# EAGLE design HesAKeeper (EAGLE 9.6.2)
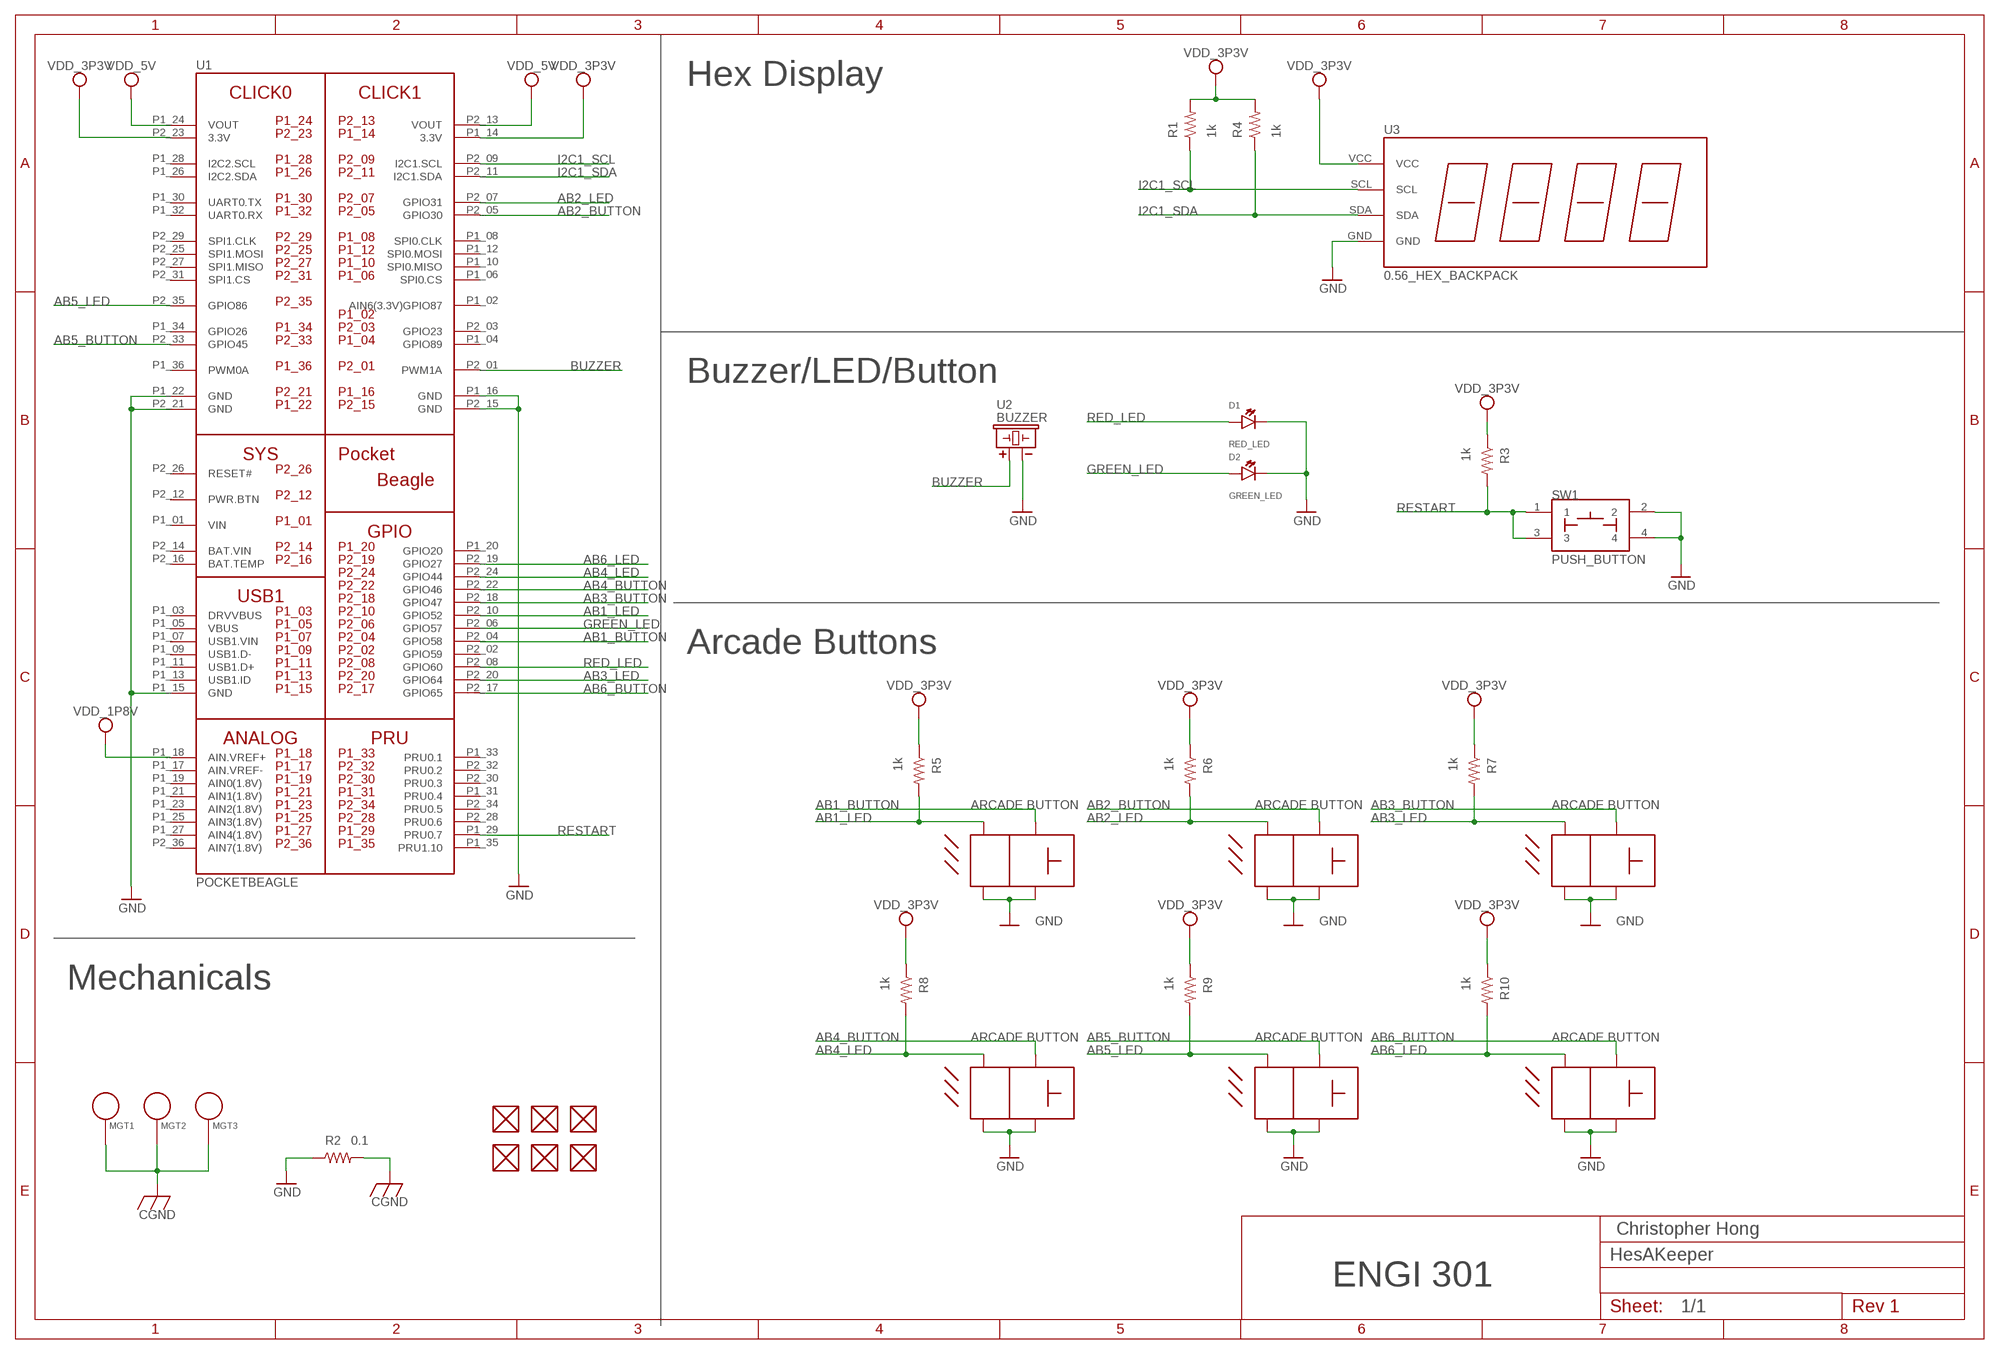
[diagram p0: schematic, sheet 1]

## Parts
AB1  ARCADE_BUTTON  [ARCADE_BUTTON]
AB2  ARCADE_BUTTON  [ARCADE_BUTTON]
AB3  ARCADE_BUTTON  [ARCADE_BUTTON]
AB4  ARCADE_BUTTON  [ARCADE_BUTTON]
AB5  ARCADE_BUTTON  [ARCADE_BUTTON]
AB6  ARCADE_BUTTON  [ARCADE_BUTTON]
D1  RED_LED  LED  [EIA-STD]
D2  GREEN_LED  LED  [EIA-STD]
FUD1  FIDUCIAL  [FIDUCIAL_40MIL]
FUD2  FIDUCIAL  [FIDUCIAL_40MIL]
FUD3  FIDUCIAL  [FIDUCIAL_40MIL]
FUD4  FIDUCIAL  [FIDUCIAL_40MIL]
FUD5  FIDUCIAL  [FIDUCIAL_40MIL]
FUD6  FIDUCIAL  [FIDUCIAL_40MIL]
MGT1  MOUNTING_HOLE  [MOUNTING_HOLE]
MGT2  MOUNTING_HOLE  [MOUNTING_HOLE]
MGT3  MOUNTING_HOLE  [MOUNTING_HOLE]
R1  1k  R_R0603  [R0603]
R2  0.1  R_R0603  [R0603]
R3  1k  R_R0603  [R0603]
R4  1k  R_R0603  [R0603]
R5  1k  R_R0603  [R0603]
R6  1k  R_R0603  [R0603]
R7  1k  R_R0603  [R0603]
R8  1k  R_R0603  [R0603]
R9  1k  R_R0603  [R0603]
R10  1k  R_R0603  [R0603]
SW1  PUSH_BUTTON  [BUTTON_12.5MM]
U1  POCKETBEAGLE  [POCKETBEAGLE]
U2  BUZZER  [BUZZER_6.5MM]
U3  0.56_HEX_BACKPACK  [0.56_HEX_BACKPACK]

## Nets
AB1_BUTTON: AB1.BUTTON_ANODE U1.P2_04(GPIO58)
AB1_LED: AB1.LED_ANODE R5.2 U1.P2_10(GPIO52)
AB2_BUTTON: AB2.BUTTON_ANODE U1.P2_05(GPIO30)
AB2_LED: AB2.LED_ANODE R6.2 U1.P2_07(GPIO31)
AB3_BUTTON: AB3.BUTTON_ANODE U1.P2_18(GPIO47)
AB3_LED: AB3.LED_ANODE R7.2 U1.P2_20(GPIO64)
AB4_BUTTON: AB4.BUTTON_ANODE U1.P2_22(GPIO46)
AB4_LED: AB4.LED_ANODE R8.2 U1.P2_24(GPIO44)
AB5_BUTTON: AB5.BUTTON_ANODE U1.P2_33(GPIO45)
AB5_LED: AB5.LED_ANODE R9.2 U1.P2_35(GPIO86)
AB6_BUTTON: AB6.BUTTON_ANODE U1.P2_17(GPIO65)
AB6_LED: AB6.LED_ANODE R10.2 U1.P2_19(GPIO27)
BUZZER: U1.P2_01(PWM1A) U2.+
CGND: MGT1.P$1 MGT2.P$1 MGT3.P$1 R2.2
GND: AB1.BUTTON_CATHODE AB1.LED_CATHODE AB2.BUTTON_CATHODE AB2.LED_CATHODE AB3.BUTTON_CATHODE AB3.LED_CATHODE AB4.BUTTON_CATHODE AB4.LED_CATHODE AB5.BUTTON_CATHODE AB5.LED_CATHODE AB6.BUTTON_CATHODE AB6.LED_CATHODE D1.CATHODE D2.CATHODE R2.1 U1.P1_15(GND) U1.P1_16(GND) U1.P1_22(GND) U1.P2_15(GND) U1.P2_21(GND) U2.- U3.GND
GREEN_LED: D2.ANODE U1.P2_06(GPIO57)
I2C1_SCL: R1.1 U1.P2_09(I2C1.SCL) U3.SCL
I2C1_SDA: R4.1 U1.P2_11(I2C1.SDA) U3.SDA
N$2: SW1.2 SW1.4 ; supply symbol labelled GND
RED_LED: D1.ANODE U1.P2_08(GPIO60)
RESTART: R3.2 SW1.1 SW1.3 U1.P1_29(PRU0.7)
VDD_1P8V: U1.P1_18(AIN.VREF+)
VDD_3P3V: R1.2 R3.1 R4.2 R5.1 R6.1 R7.1 R8.1 R9.1 R10.1 U1.P1_14(3.3V) U1.P2_23(3.3V) U3.VCC
VDD_5V: U1.P1_24(VOUT) U1.P2_13(VOUT)
Unconnected: FUD1.P$1 FUD2.P$1 FUD3.P$1 FUD4.P$1 FUD5.P$1 FUD6.P$1 U1.P1_02(AIN6(3.3V)GPIO87) U1.P1_03(DRVVBUS) U1.P1_04(GPIO89) U1.P1_05(VBUS) U1.P1_06(SPI0.CS) U1.P1_07(USB1.VIN) U1.P1_08(SPI0.CLK) U1.P1_09(USB1.D-) U1.P1_10(SPI0.MISO) U1.P1_11(USB1.D+) U1.P1_12(SPI0.MOSI) U1.P1_13(USB1.ID) U1.P1_17(AIN.VREF-) U1.P1_19(AIN0(1.8V)) U1.P1_20(GPIO20) U1.P1_21(AIN1(1.8V)) U1.P1_23(AIN2(1.8V)) U1.P1_25(AIN3(1.8V)) U1.P1_26(I2C2.SDA) U1.P1_27(AIN4(1.8V)) U1.P1_28(I2C2.SCL) U1.P1_30(UART0.TX) U1.P1_31(PRU0.4) U1.P1_32(UART0.RX) U1.P1_33(PRU0.1) U1.P1_34(GPIO26) U1.P1_35(PRU1.10) U1.P1_36(PWM0A) U1.P2_02(GPIO59) U1.P2_03(GPIO23) U1.P2_12(PWR.BTN) U1.P2_16(BAT.TEMP) U1.P2_25(SPI1.MOSI) U1.P2_26(RESET#) U1.P2_27(SPI1.MISO) U1.P2_28(PRU0.6) U1.P2_29(SPI1.CLK) U1.P2_30(PRU0.3) U1.P2_31(SPI1.CS) U1.P2_32(PRU0.2) U1.P2_34(PRU0.5) U1.P2_36(AIN7(1.8V))

## Notes on the sheet
- Hex Display
- Buzzer/LED/Button
- Arcade Buttons
- Mechanicals
- Christopher Hong
- ENGI 301
- 1/1

## Power pins joined to a net without a drawn wire
BAT.VIN: U1.P2_14(BAT.VIN)
VIN: U1.P1_01(VIN)

## Library data of the parts
AB1-AB6 = HesAKeeper:ARCADE_BUTTON: Arcade Button for He's A Keeper Project
D1 D2 = combo_lock:LED: EIA-STD LED, LTST-C191TBKT
FUD1-FUD6 = combo_lock:FIDUCIAL
MGT1-MGT3 = combo_lock:MOUNTING_HOLE: Chassis Mounting Hole w/GND connection ability
R1-R10 = combo_lock:R_: RESISTOR, American symbol
SW1 = combo_lock:PUSH_BUTTON
U1 = combo_lock:POCKETBEAGLE
U2 = combo_lock:BUZZER: CEM-1203 Buzzer
U3 = combo_lock:0.56_HEX_BACKPACK: 0.56" LED HEX Backback - Adafruit HT16K33 - https://www.adafruit.com/product/878 - https://www.adafruit.com/product/879 - https://www.adafruit.com/product/880 - https://www.adafruit.com/product/881 - https://www.adafruit.com/product/1002

## Board
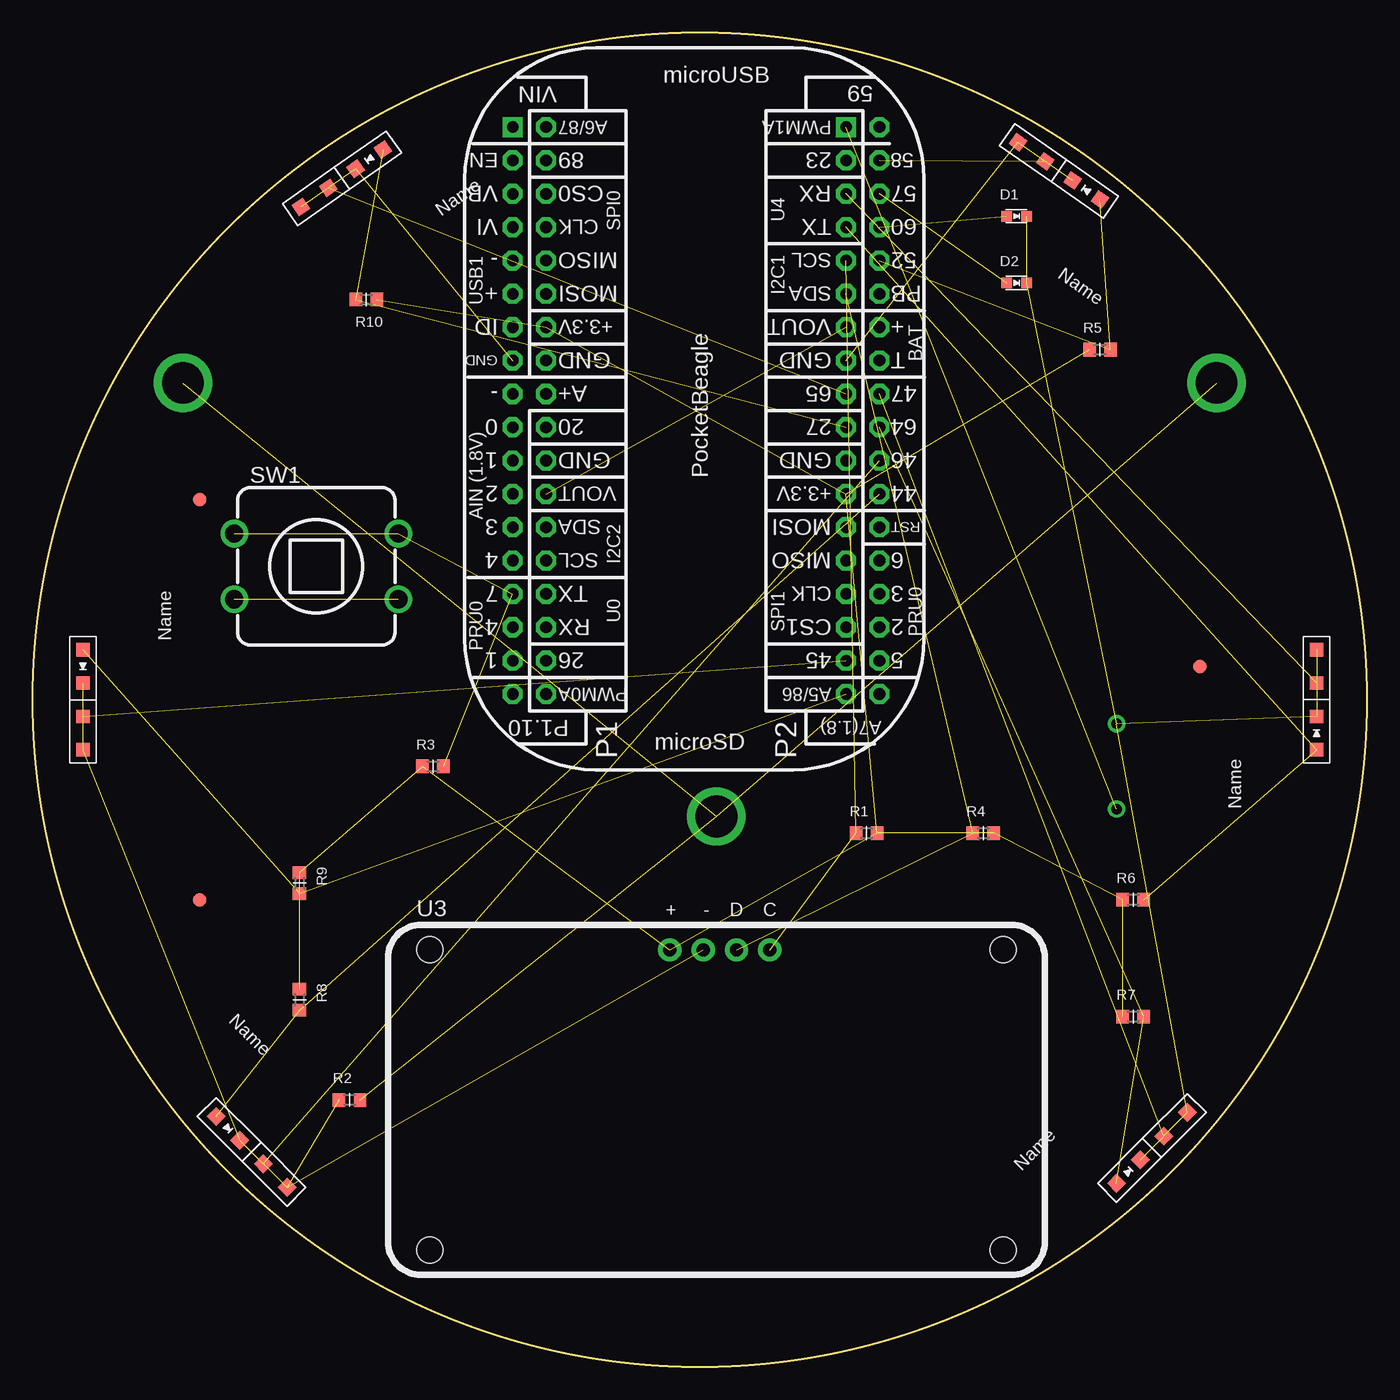
[diagram p1: board, top side]
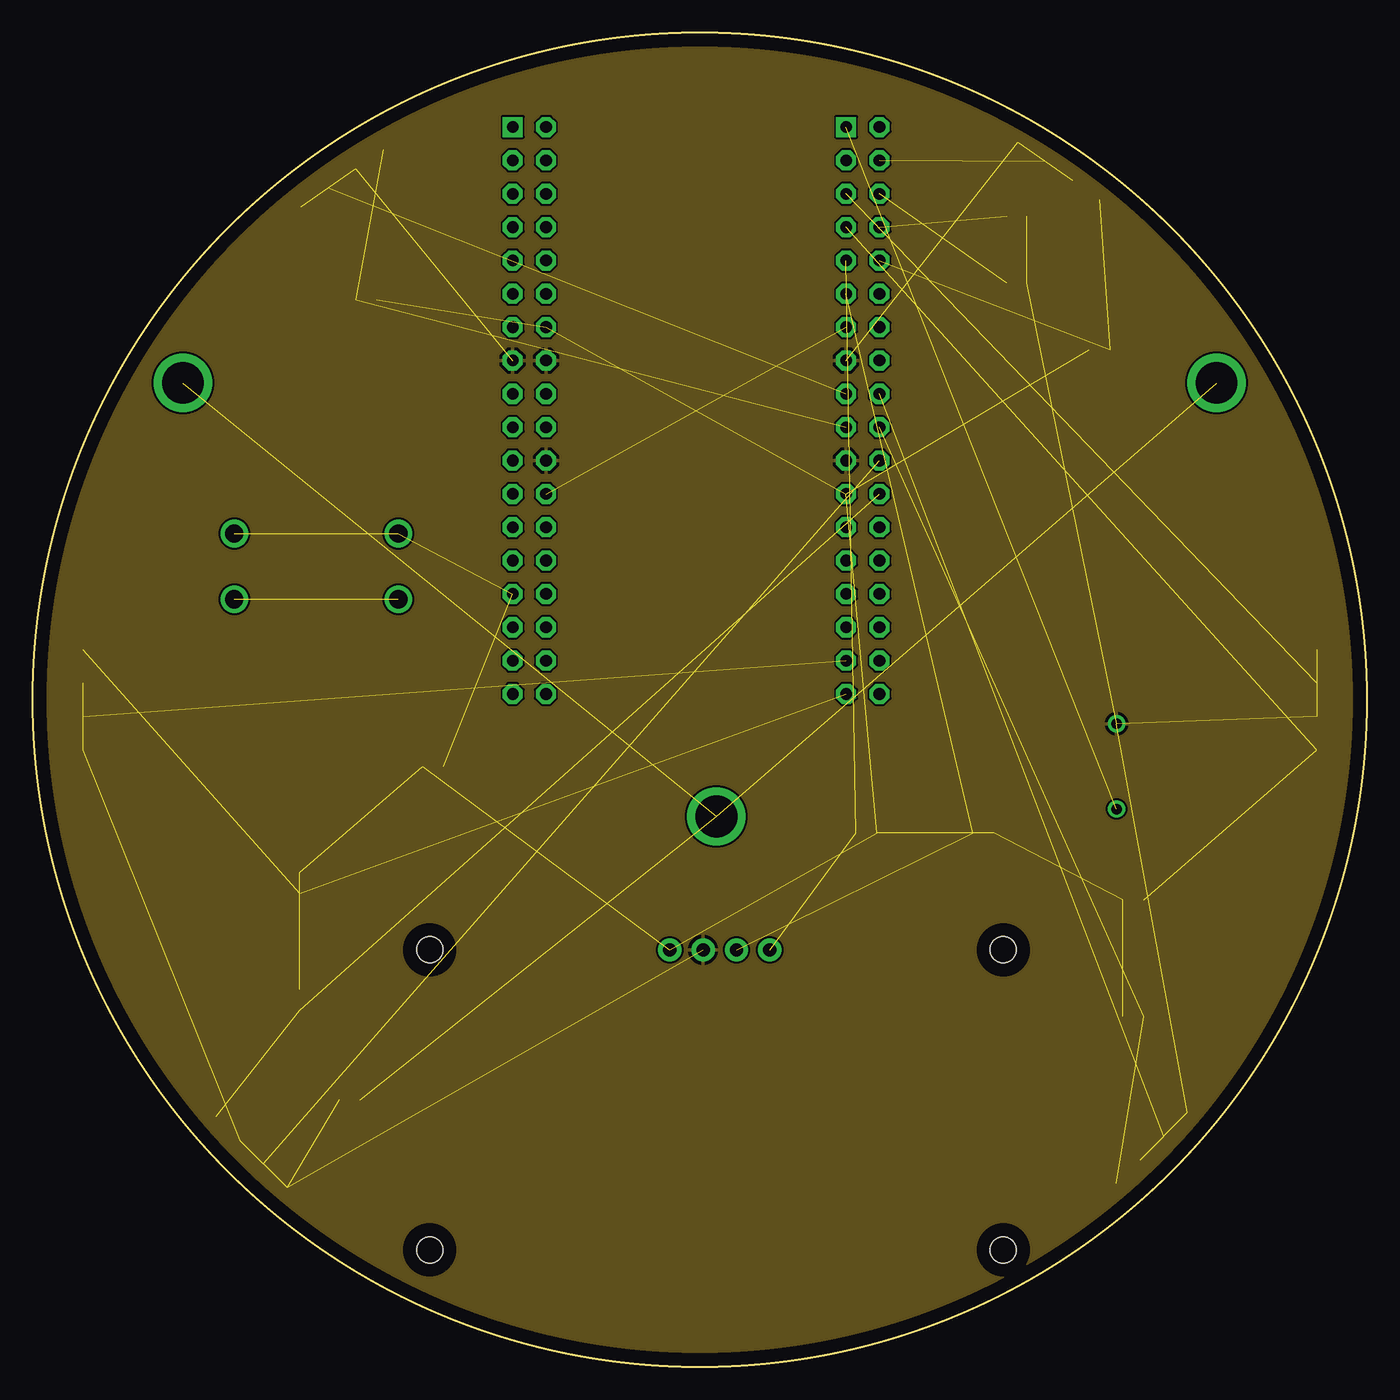
[diagram p2: board, inner layer Route2]
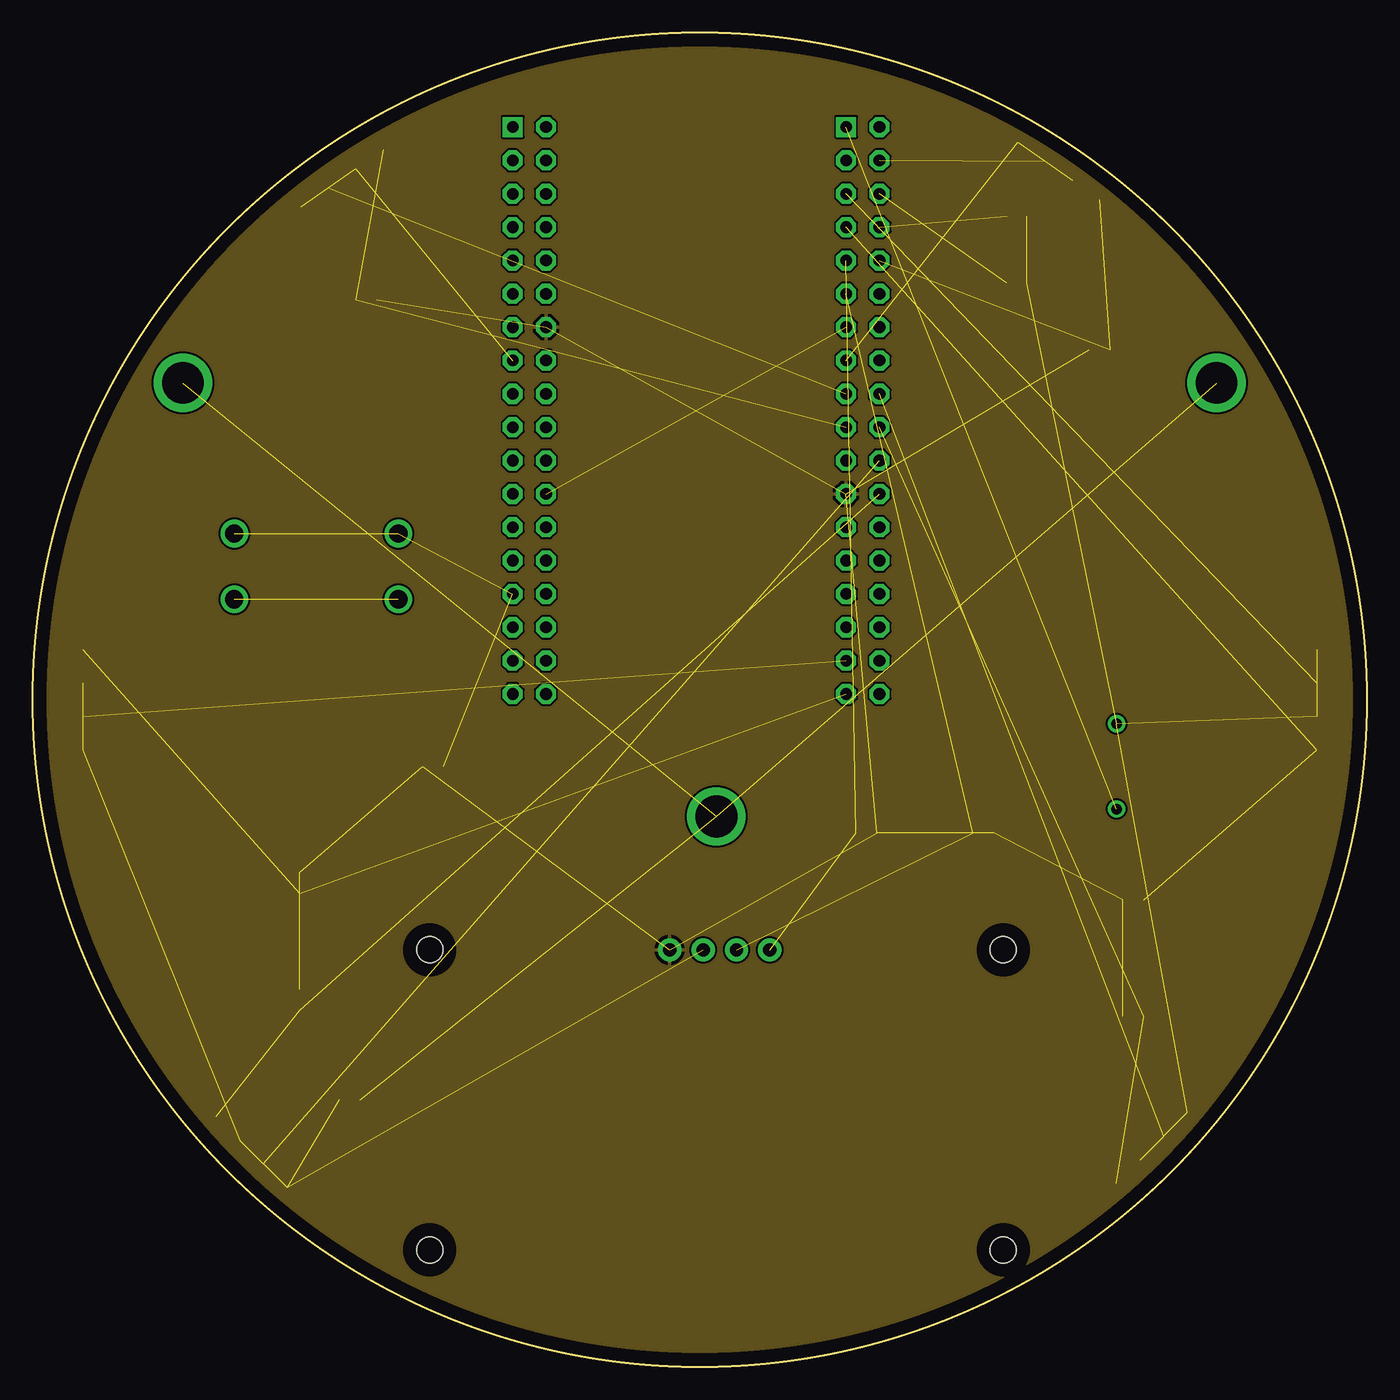
[diagram p3: board, inner layer Route15]
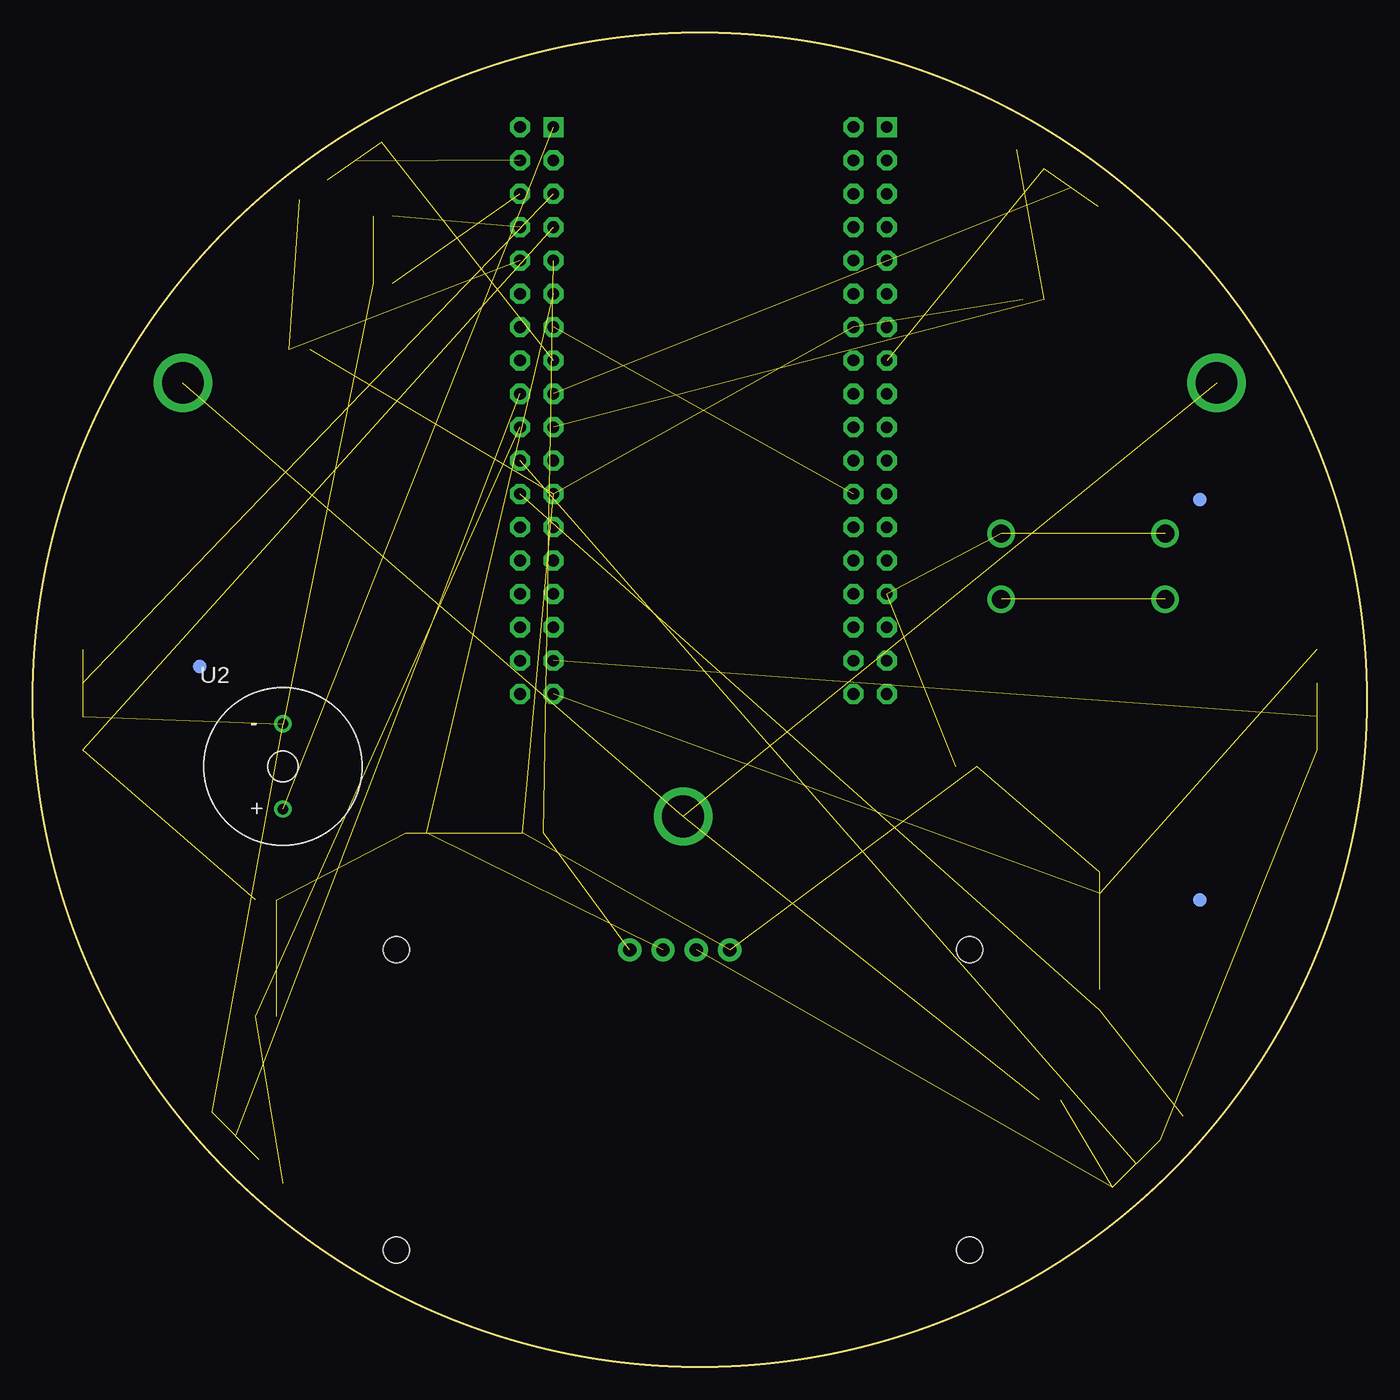
[diagram p4: board, bottom side, seen from below]

Size 101.6 x 101.6 mm. Coordinates in mm from the lower left corner, seen from the top.
Outline: circle at 50.8,50.8 radius 50.8
Copper layers (1*16): Top 0.035mm / dielectric 1.5mm / Bottom 0.035mm
Design rules "default": minimum track width 6mil, minimum drill 0.35mm, track to track 6mil, track to pad 6mil, pad to pad 6mil, via to via 6mil, smd to smd 6mil, copper to edge 40mil, drill to drill 6mil, minimum pad ring 10mil, minimum via ring 8mil, stop-mask expansion 4mil, vias tented up to drill 0mil, thermal gap 10mil

### Footprints (pad centres in the part's own frame; a part is rotated, then mirrored left to right if it is on the bottom)
ARCADE_BUTTON = smd 1.016 x 1.016: BUTTON_ANODE 5.08,0; BUTTON_CATHODE 7.62,0; LED_ANODE 0,0; LED_CATHODE 2.54,0
EIA-STD = smd 0.8 x 0.8: ANODE -0.75,0; CATHODE 0.75,0
FIDUCIAL_40MIL = smd 1.016 x 1.016: P$1 0,0
MOUNTING_HOLE = drill 3.175 pad 4.445: P$1 0,0
R0603 = smd 0.95 x 1.031: 1 -0.8,0; 2 0.8,0
BUTTON_12.5MM = drill 1.4: 1 -6.25,2.5; 2 -6.25,-2.5; 3 6.25,2.5; 4 6.25,-2.5
POCKETBEAGLE = drill 0.889 pad 1.524 square: P1_01 5.91,3.53; P2_01 5.91,28.93 | drill 0.889 pad 1.524 octagon: P1_02 5.91,6.07; P1_03 8.45,3.53; P1_04 8.45,6.07; P1_05 10.99,3.53; P1_06 10.99,6.07; P1_07 13.53,3.53; P1_08 13.53,6.07; P1_09 16.07,3.53; P1_10 16.07,6.07; P1_11 18.61,3.53; P1_12 18.61,6.07; P1_13 21.15,3.53; P1_14 21.15,6.07; P1_15 23.69,3.53; P1_16 23.69,6.07; P1_17 26.23,3.53; P1_18 26.23,6.07; P1_19 28.77,3.53; P1_20 28.77,6.07; P1_21 31.31,3.53; P1_22 31.31,6.07; P1_23 33.85,3.53; P1_24 33.85,6.07; P1_25 36.39,3.53; P1_26 36.39,6.07; P1_27 38.93,3.53; P1_28 38.93,6.07; P1_29 41.47,3.53; P1_30 41.47,6.07; P1_31 44.01,3.53; P1_32 44.01,6.07; P1_33 46.55,3.53; P1_34 46.55,6.07; P1_35 49.09,3.53; P1_36 49.09,6.07; P2_02 5.91,31.47; P2_03 8.45,28.93; P2_04 8.45,31.47; P2_05 10.99,28.93; P2_06 10.99,31.47; P2_07 13.53,28.93; P2_08 13.53,31.47; P2_09 16.07,28.93; P2_10 16.07,31.47; P2_11 18.61,28.93; P2_12 18.61,31.47; P2_13 21.15,28.93; P2_14 21.15,31.47; P2_15 23.69,28.93; P2_16 23.69,31.47; P2_17 26.23,28.93; P2_18 26.23,31.47; P2_19 28.77,28.93; P2_20 28.77,31.47; P2_21 31.31,28.93; P2_22 31.31,31.47; P2_23 33.85,28.93; P2_24 33.85,31.47; P2_25 36.39,28.93; P2_26 36.39,31.47; P2_27 38.93,28.93; P2_28 38.93,31.47; P2_29 41.47,28.93; P2_30 41.47,31.47; P2_31 44.01,28.93; P2_32 44.01,31.47; P2_33 46.55,28.93; P2_34 46.55,31.47; P2_35 49.09,28.93; P2_36 49.09,31.47
BUZZER_6.5MM = drill 0.8: + 0,-3.25; - 0,3.25
0.56_HEX_BACKPACK = drill 1.016 pad 1.778: GND -1.016,11.43; SCL 4.064,11.43; SDA 1.524,11.43; VCC -3.556,11.43 | hole 2: -21.844,-11.43; 21.844,-11.43; -21.844,11.43; 21.844,11.43

### Placement (x,y rotation side)
AB1  81.28,88.9 145 top
AB2  97.79,46.99 90 top
AB3  82.55,13.97 45 top
AB4  13.97,19.05 315 top
AB5  3.81,54.61 270 top
AB6  26.67,92.71 215 top
D1  74.93,87.63 0 top
D2  74.93,82.55 0 top
FUD1  12.7,35.56 0 top
FUD2  12.7,66.04 0 top
FUD3  88.9,53.34 0 top
FUD4  88.9,53.34 180 bottom
FUD5  12.7,66.04 0 bottom
FUD6  12.7,35.56 0 bottom
MGT1  11.43,74.93 0 top
MGT2  90.17,74.93 0 top
MGT3  52.07,41.91 0 top
R1  63.5,40.64 0 top
R2  24.13,20.32 0 top
R3  30.48,45.72 0 top
R4  72.39,40.64 0 top
R5  81.28,77.47 0 top
R6  83.82,35.56 0 top
R7  83.82,26.67 0 top
R8  20.32,27.94 270 top
R9  20.32,36.83 270 top
R10  25.4,81.28 180 top
SW1  21.59,60.96 0 top
U1  33.02,100.33 270 top
U2  82.55,45.72 0 bottom
U3  52.07,20.32 0 top

### Tracks (layer width: path | path; a pad name or v marks a point on that pad's centre or on a via)
AB1_BUTTON  (1 unrouted)
AB1_LED  (2 unrouted)
AB2_BUTTON  (1 unrouted)
AB2_LED  (2 unrouted)
AB3_BUTTON  (1 unrouted)
AB3_LED  (2 unrouted)
AB4_BUTTON  (1 unrouted)
AB4_LED  (2 unrouted)
AB5_BUTTON  (1 unrouted)
AB5_LED  (2 unrouted)
AB6_BUTTON  (1 unrouted)
AB6_LED  (2 unrouted)
BUZZER  (1 unrouted)
CGND  (3 unrouted)
GND  (15 unrouted)
  pour Route2 (rank 6): -2.54,81.28 -2.54,20.32 50.8,-12.7 104.14,20.32 104.14,81.28 50.8,114.3
GREEN_LED  (1 unrouted)
I2C1_SCL  (2 unrouted)
I2C1_SDA  (2 unrouted)
N$2  (1 unrouted)
RED_LED  (1 unrouted)
RESTART  (3 unrouted)
VDD_3P3V  (11 unrouted)
  pour Route15 (rank 6): -5.08,17.78 -5.08,83.82 50.8,116.84 106.68,83.82 106.68,17.78 50.8,-15.24
VDD_5V  (1 unrouted)